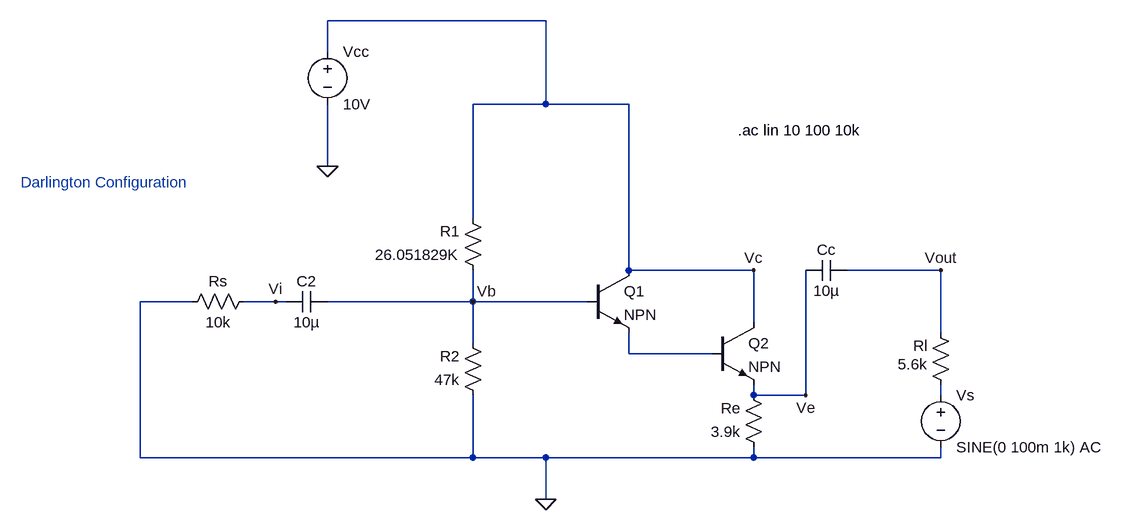
[diagram p0: schematic Darlington.asc]
Darlington.asc, the LTspice schematic file:
Version 4
SHEET 1 1404 680
WIRE 544 -352 208 -352
WIRE 208 -304 208 -352
WIRE 544 -224 544 -352
WIRE 544 -224 432 -224
WIRE 672 -224 544 -224
WIRE 208 -128 208 -224
WIRE 432 -48 432 -224
WIRE 672 32 672 -224
WIRE 864 32 672 32
WIRE 1152 32 1008 32
WIRE 0 80 -80 80
WIRE 128 80 80 80
WIRE 144 80 128 80
WIRE 432 80 432 32
WIRE 432 80 208 80
WIRE 608 80 432 80
WIRE 864 112 864 32
WIRE 1152 128 1152 32
WIRE 432 144 432 80
WIRE 672 160 672 128
WIRE 800 160 672 160
WIRE 864 224 864 208
WIRE 944 224 944 32
WIRE 944 224 864 224
WIRE 1152 224 1152 208
WIRE -80 320 -80 80
WIRE 432 320 432 224
WIRE 432 320 -80 320
WIRE 544 320 432 320
WIRE 864 320 864 304
WIRE 864 320 544 320
WIRE 1152 320 1152 304
WIRE 1152 320 864 320
WIRE 544 384 544 320
FLAG 208 -128 0
FLAG 128 80 Vi
FLAG 432 80 Vb
FLAG 544 384 0
FLAG 864 32 Vc
FLAG 1152 32 Vout
FLAG 944 224 Ve
SYMBOL res 96 64 R90
WINDOW 0 0 56 VBottom 2
WINDOW 3 32 56 VTop 2
SYMATTR InstName Rs
SYMATTR Value 10k
SYMBOL res 448 240 R180
WINDOW 0 36 76 Left 2
WINDOW 3 36 40 Left 2
SYMATTR InstName R2
SYMATTR Value 47k
SYMBOL res 448 48 R180
WINDOW 0 36 76 Left 2
WINDOW 3 36 40 Left 2
SYMATTR InstName R1
SYMATTR Value 26.051829K
SYMBOL npn 608 32 R0
SYMATTR InstName Q1
SYMBOL voltage 208 -320 R0
SYMATTR InstName Vcc
SYMATTR Value 10V
SYMBOL res 1168 224 R180
WINDOW 0 36 76 Left 2
WINDOW 3 36 48 Left 2
SYMATTR InstName Rl
SYMATTR Value 5.6k
SYMBOL cap 1008 16 R90
WINDOW 0 0 32 VBottom 2
WINDOW 3 32 32 VTop 2
SYMATTR InstName Cc
SYMATTR Value 10µ
SYMBOL npn 800 112 R0
SYMATTR InstName Q2
SYMBOL res 880 320 R180
WINDOW 0 36 76 Left 2
WINDOW 3 36 40 Left 2
SYMATTR InstName Re
SYMATTR Value 3.9k
SYMBOL cap 208 64 R90
WINDOW 0 0 32 VBottom 2
WINDOW 3 32 32 VTop 2
SYMATTR InstName C2
SYMATTR Value 10µ
SYMBOL voltage 1152 208 R0
WINDOW 123 0 0 Left 0
WINDOW 39 0 0 Left 0
SYMATTR InstName Vs
SYMATTR Value SINE(0 100m 1k) AC
TEXT -264 -104 Left 2 ;Darlington Configuration
TEXT 840 -184 Left 2 !.ac lin 10 100 10k

The netlist it stands for:
* Darlington.asc
Rs Vi 0 10k
R2 0 Vb 47k
R1 Vb Vc 26.051829K
Q1 Vc Vb N001 0 NPN
Vcc Vc 0 10V
Rl N002 Vout 5.6k
Cc Vout Ve 10µ
Q2 Vc N001 Ve 0 NPN
Re 0 Ve 3.9k
C2 Vb Vi 10µ
Vs N002 0 SINE(0 100m 1k) AC
.model NPN NPN
.model PNP PNP
.lib standard.bjt
* Darlington Configuration
.ac lin 10 100 10k
.backanno
.end